# EAGLE design supply_test_2v1 (EAGLE 6.5.0)

## Sheet 1 of 3: AC-DC Power Supply
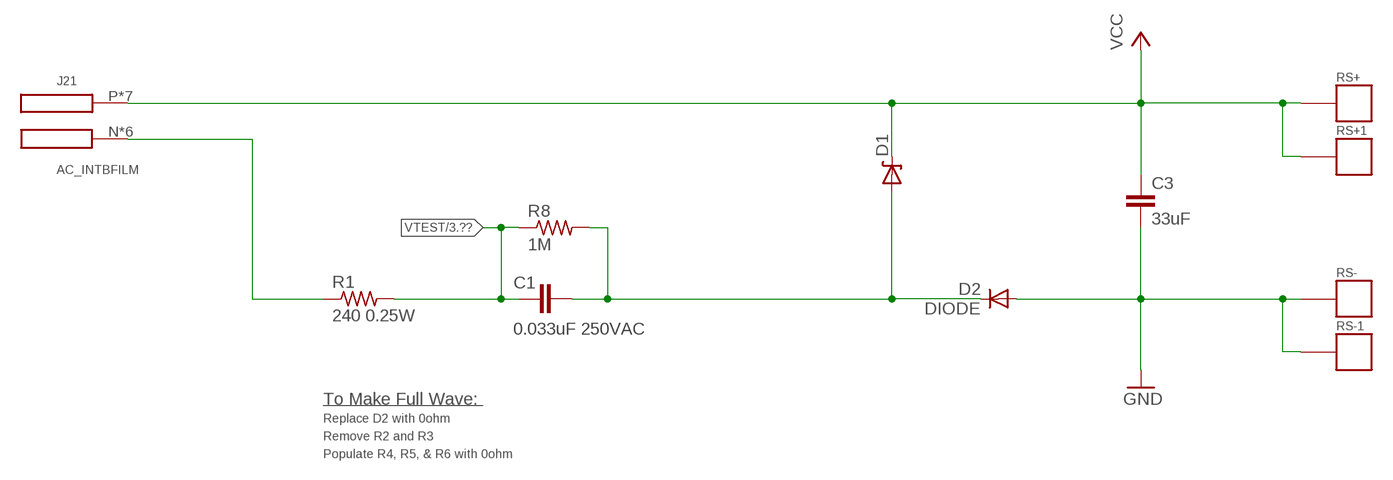
[diagram p0: schematic, sheet 1]

### Parts
C1  0.033uF 250VAC  C-EUEDGE  [C2220-EDGE]
C3  33uF  C-EUC0603  [C0603]
D1  ZENERBZT52  [BZT52]
D2  DIODE  [BAS521]
J21  AC_INTBFILM  [AC3_TBFILM]
R1  240 0.25W  R-US_R0603  [R0603]
R8  1M  R-US_R0603  [R0603]
RS+  TP_LONG  [TP_LONG]
RS+1  TP_SMD  [TP_SMD]
RS-  TP_LONG  [TP_LONG]
RS-1  TP_SMD  [TP_SMD]

### Nets
GND: C3.2 D2.A RS-1.P$1 RS-.P$1 ; also sheet 2,3
N$2: J21.N J21.N1(N) J21.N2(N) J21.N3(N) J21.N4(N) J21.N5(N) R1.1
N$4: C1.1 D1.A D2.C R8.2
VCC: C3.1 D1.C J21.P J21.P1(P) J21.P2(P) J21.P3(P) J21.P4(P) J21.P5(P) J21.P6(P) RS+1.P$1 RS+.P$1 ; also sheet 2
VTEST: C1.2 R1.2 R8.1 ; also sheet 3

### Notes on the sheet
- To Make Full Wave:
- Replace D2 with 0ohm
- Remove R2 and R3
- Populate R4, R5, & R6 with 0ohm

## Sheet 2 of 3: Load Supply Regulation
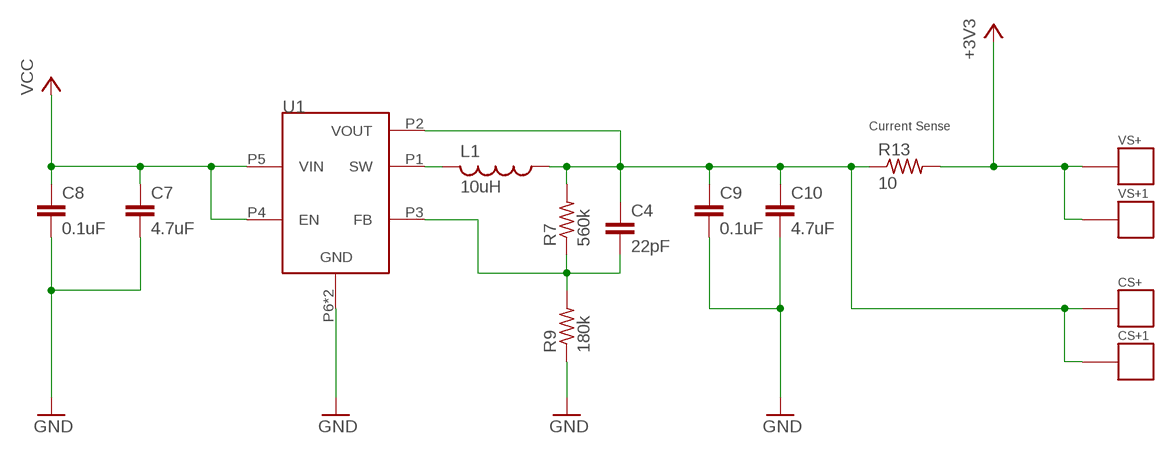
[diagram p1: schematic, sheet 2]

### Parts
C4  22pF  C-EUC0402  [C0402]
C7  4.7uF  C-EUC0402  [C0402]
C8  0.1uF  C-EUC0402  [C0402]
C9  0.1uF  C-EUC0402  [C0402]
C10  4.7uF  C-EUC0603  [C0603]
CS+  TP_LONG  [TP_LONG]
CS+1  TP_SMD  [TP_SMD]
L1  10uH  L-USL0805  [L0805]
R7  560k  R-US_R0402  [R0402]
R9  180k  R-US_R0402  [R0402]
R13  10  R-US_R0603  [R0603]
U1  TPS62122  [WDFN-6]
VS+  TP_LONG  [TP_LONG]
VS+1  TP_SMD  [TP_SMD]

### Nets
+3V3: R13.2 VS+1.P$1 VS+.P$1 ; also sheet 3
GND: C7.2 C8.2 C9.2 C10.2 R9.1 U1.P6(GND) U1.PAD(GND) ; also sheet 1,3
N$9: L1.2 U1.P1(SW)
N$11: C4.1 C9.1 C10.1 CS+1.P$1 CS+.P$1 L1.1 R7.2 R13.1 U1.P2(VOUT)
N$13: C4.2 R7.1 R9.2 U1.P3(FB)
VCC: C7.1 C8.1 U1.P4(EN) U1.P5(VIN) ; also sheet 1

### Notes on the sheet
- Current Sense

## Sheet 3 of 3: Power Sensing!
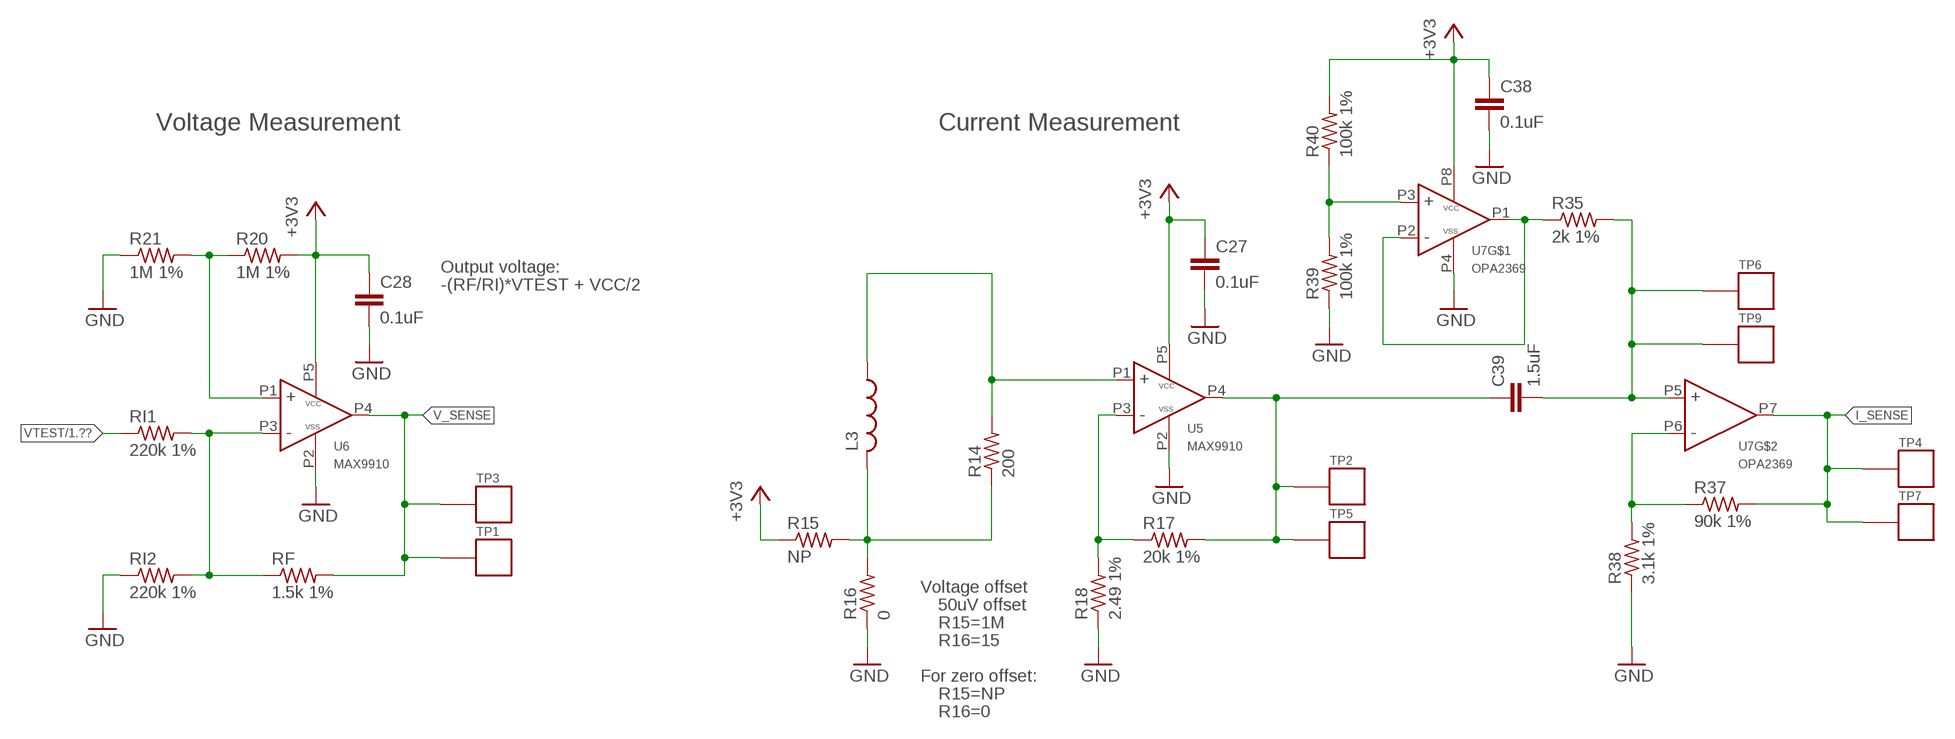
[diagram p2: schematic, sheet 3]

### Parts
C27  0.1uF  C-EUC0402  [C0402]
C28  0.1uF  C-EUC0402  [C0402]
C38  0.1uF  C-EUC0402  [C0402]
C39  1.5uF  C-EUC0402  [C0402]
L3  L-USL0805  [L0805]
R14  200  R-US_R0402  [R0402]
R15  NP  R-US_R0402  [R0402]
R16  0  R-US_R0402  [R0402]
R17  20k 1%  R-US_R0402  [R0402]
R18  2.49 1%  R-US_R0402  [R0402]
R20  1M 1%  R-US_R0402  [R0402]
R21  1M 1%  R-US_R0402  [R0402]
R35  2k 1%  R-US_R0402  [R0402]
R37  90k 1%  R-US_R0402  [R0402]
R38  3.1k 1%  R-US_R0402  [R0402]
R39  100k 1%  R-US_R0402  [R0402]
R40  100k 1%  R-US_R0402  [R0402]
RF  1.5k 1%  R-US_R0402  [R0402]
RI1  220k 1%  R-US_R0402  [R0402]
RI2  220k 1%  R-US_R0402  [R0402]
TP1  TP_SMD  [TP_SMD]
TP2  TP_LONG  [TP_LONG]
TP3  TP_LONG  [TP_LONG]
TP4  TP_LONG  [TP_LONG]
TP5  TP_SMD  [TP_SMD]
TP6  TP_SMD  [TP_SMD]
TP7  TP_SMD  [TP_SMD]
TP9  TP_LONG  [TP_LONG]
U5  MAX9910  [SC70-5]
U6  MAX9910  [SC70-5]
U7  OPA2369  [SOT-23-8]

### Nets
+3V3: C27.1 C28.1 C38.1 R15.1 R20.2 R40.2 U5.P5(VCC) U6.P5(VCC) U7.P8(VCC) ; also sheet 2
GND: C27.2 C28.2 C38.2 R16.1 R18.1 R21.1 R38.1 R39.1 RI2.1 U5.P2(VSS) U6.P2(VSS) U7.P4(VSS) ; also sheet 1,2
I_SENSE: R37.2 TP4.P$1 TP7.P$1 U7.P7(OUT)
N$37: L3.2 R14.1 R15.2 R16.2
N$38: L3.1 R14.2 U5.P1(IN+)
N$40: R20.1 R21.2 U6.P1(IN+)
N$41: RF.1 RI1.2 RI2.2 U6.P3(IN-)
N$61: C39.1 R17.2 TP2.P$1 TP5.P$1 U5.P4(OUT)
N$65: R17.1 R18.2 U5.P3(IN-)
N$66: R37.1 R38.2 U7.P6(IN-)
N$67: C39.2 R35.2 TP6.P$1 TP9.P$1 U7.P5(IN+)
N$68: R35.1 U7.P1(OUT) U7.P2(IN-)
N$70: R39.2 R40.1 U7.P3(IN+)
V_SENSE: RF.2 TP1.P$1 TP3.P$1 U6.P4(OUT)
VTEST: RI1.1 ; also sheet 1

### Notes on the sheet
- Voltage Measurement | Current Measurement
- Output voltage:
- -(RF/RI)*VTEST + VCC/2
- Voltage offset
- 50uV offset
- R15=1M
- R16=15
- For zero offset:
- R15=NP
- R16=0

## Library data of the parts
C1 = rcl:C-EU: CAPACITOR, European symbol; DIGIKEY: 490-4238-1-ND
C3 = rcl:C-EU: CAPACITOR, European symbol; DIGIKEY: 718-1672-1-ND
C4 = rcl:C-EU: CAPACITOR, European symbol
C7 C10 = rcl:C-EU: CAPACITOR, European symbol; DIGIKEY: 587-2786-1-ND
C8 C9 = rcl:C-EU: CAPACITOR, European symbol; DIGIKEY: 1276-1001-1-ND
C27 C28 C38 = rcl:C-EU: CAPACITOR, European symbol; DIGIKEY: 445-1265-1-ND
C39 = rcl:C-EU: CAPACITOR, European symbol; DIGIKEY: 445-13874-1-ND
CS+ CS+1 RS+ RS+1 RS- RS-1 VS+ VS+1 = skyspecs:TP; DIGIKEY: NP
D1 = powerfilm:ZENER; DIGIKEY: BZT52C10T-7DICT-ND; DIGIKEY_2: BZT52C15T-7DICT-ND
D2 = powerfilm:DIODE; DIGIKEY: BAS521-7DICT-ND
J21 = powerfilm:AC_IN; DIGIKEY: NP
L1 = rcl:L-US: INDUCTOR, American symbol; DIGIKEY: 490-4990-1-ND
L3 = rcl:L-US: INDUCTOR, American symbol; DIGIKEY: 732-3452-1-ND
R1 = rcl:R-US_: RESISTOR, American symbol; DIGIKEY: RHM240DCT-ND
R7 R9 = rcl:R-US_: RESISTOR, American symbol
R8 = rcl:R-US_: RESISTOR, American symbol; DIGIKEY: MCT0603-1.00M-CFCT-ND
R13 = rcl:R-US_: RESISTOR, American symbol; DIGIKEY: CRT0603-BY-10R0ELFCT-ND
R14 = rcl:R-US_: RESISTOR, American symbol; DIGIKEY: P200LCT-ND
R15 = rcl:R-US_: RESISTOR, American symbol; DIGIKEY: NP
R16 = rcl:R-US_: RESISTOR, American symbol; DIGIKEY: P0.0JCT-ND
R17 = rcl:R-US_: RESISTOR, American symbol; DIGIKEY: P20.0KLCT-ND
R18 = rcl:R-US_: RESISTOR, American symbol; DIGIKEY: 541-2.49LLCT-ND
R20 R21 = rcl:R-US_: RESISTOR, American symbol; DIGIKEY: P10.0KLCT-ND
R35 = rcl:R-US_: RESISTOR, American symbol; DIGIKEY: P2.00KLCT-ND
R37 = rcl:R-US_: RESISTOR, American symbol; DIGIKEY: P90.9KLCT-ND
R38 = rcl:R-US_: RESISTOR, American symbol; DIGIKEY: P3.09KHCT-ND
R39 R40 = rcl:R-US_: RESISTOR, American symbol; DIGIKEY: P100KLCT-ND
RF = rcl:R-US_: RESISTOR, American symbol; DIGIKEY: P1.50KLCT-ND
RI1 RI2 = rcl:R-US_: RESISTOR, American symbol; DIGIKEY: P220KLCT-ND
TP1 TP3 = skyspecs:TP; DIGIKEY: 5129K-ND
TP2 TP4-TP7 TP9 = skyspecs:TP; DIGIKEY: 5126K-ND
U1 = powerfilm:TPS62122; DIGIKEY: 296-27695-1-ND
U5 U6 = powerfilm:MAX9910; DIGIKEY: MAX9910EXK+TCT-ND
U7 = powerfilm:OPA2369; DIGIKEY: 296-22671-1-ND

## Board
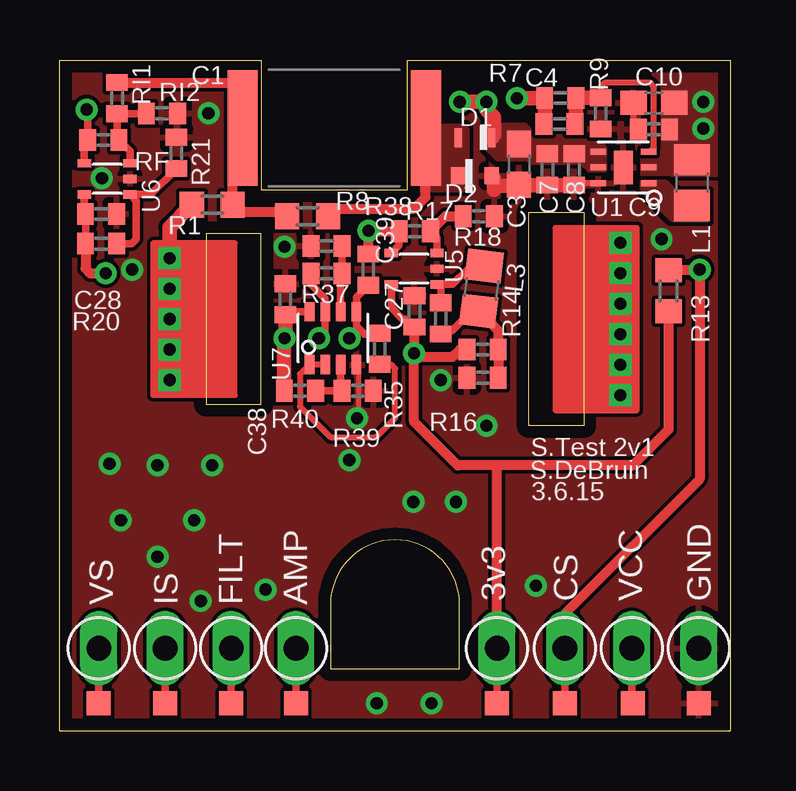
[diagram p3: board, top side]
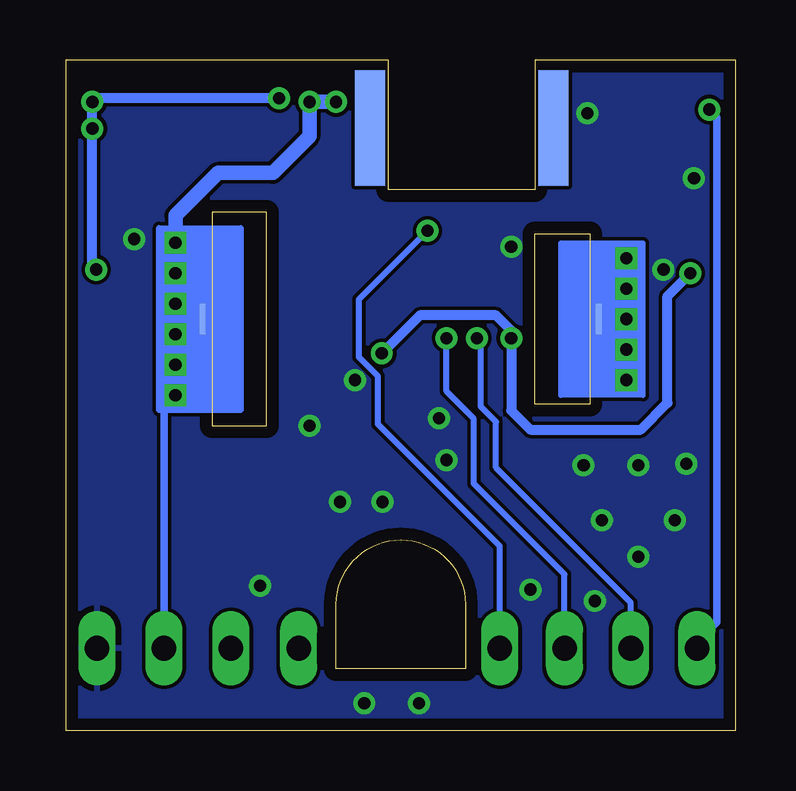
[diagram p4: board, bottom side, seen from below]

Size 27.94 x 27.94 mm. Coordinates in mm from the lower left corner, seen from the top.
Copper layers (1*16): Top 0.0178mm / dielectric 59mil / Bottom 0.0178mm
Design rules "SSC-EAGLE-2Lyr_v1.0.0.3": minimum track width 6mil, minimum drill 14mil, track to track 6mil, track to pad 6mil, pad to pad 6mil, via to via 6mil, smd to smd 6mil, copper to edge 20mil, drill to drill 16mil, minimum pad ring 8mil, minimum via ring 8mil, stop-mask expansion 3mil, vias tented up to drill 0mil, thermal gap 10mil

### Footprints (pad centres in the part's own frame; a part is rotated, then mirrored left to right if it is on the bottom)
C2220-EDGE = smd 1.25 x 4.8: 1 -3.82,0; 2 3.82,0 | smd 1.25 x 4.8 bottom: 3 3.82,0; 4 -3.82,0
C0603 = smd 1.1 x 1: 1 -0.85,0; 2 0.85,0
C0402 = smd 0.7 x 0.9: 1 -0.65,0; 2 0.65,0
TP_LONG = drill 1.029 long: P$1 0,0
TP_SMD = smd 1 x 1: P$1 0,0
BZT52 = smd 0.3 x 0.8: A -0.7,0; C 0.7,0
BAS521 = smd 0.6 x 0.7: A -0.7,0; C 0.7,0
AC3_TBFILM = smd 0.254 x 1.27 bottom: N -8.255,0; P 8.255,0 | drill 0.508 square: N1 -9.398,-2.54; N2 -9.398,-1.27; N3 -9.398,0; N4 -9.398,1.27; N5 -9.398,2.54; P1 9.398,-3.175; P2 9.398,-1.905; P3 9.398,-0.635; P4 9.398,0.635; P5 9.398,1.905; P6 9.398,3.175
L0805 = smd 1.3 x 1.5: 1 -0.95,0; 2 0.95,0
R0603 = smd 1 x 1.1: 1 -0.85,0; 2 0.85,0
R0402 = smd 0.7 x 0.9: 1 -0.65,0; 2 0.65,0
WDFN-6 = smd 0.65 x 0.25: P1 -1.05,0.65; P2 -1.05,0; P3 -1.05,-0.65; P4 1.05,-0.65; P5 1.05,0; P6 1.05,0.65 | smd 0.8 x 1.4: PAD 0,0
SC70-5 = smd 0.55 x 0.35: P1 -0.95,0.65; P2 -0.95,0; P3 -0.95,-0.65; P4 0.95,-0.65; P5 0.95,0.65
SOT-23-8 = smd 0.8 x 0.4: P1 -1.1,0.975; P2 -1.1,0.325; P3 -1.1,-0.325; P4 -1.1,-0.975; P5 1.1,-0.975; P6 1.1,-0.325; P7 1.1,0.325; P8 1.1,0.975

### Placement (x,y rotation side)
C1  11.43,25.11 180 top
C3  19.13,23.59 270 top
C4  20.82,25.27 0 top
C7  20.32,23.38 270 top
C8  21.43,23.38 270 top
C9  24.77,25.05 180 top
C10  24.77,26.16 180 top
C27  14.78,17.46 90 top
C28  1.71,21.53 0 top
C38  9.4,17.97 90 top
C39  12.86,19.21 270 top
CS+  21.05,3.43 90 top
CS+1  21.05,1.14 0 top
D1  17.3,24.7 0 top
D2  17.3,23.11 180 top
J21  13.97,17.14 0 top
L1  26.35,22.83 270 top
L3  17.58,18.41 262.9 top
R1  6.35,21.91 0 top
R7  20.86,26.35 180 top
R8  10.32,21.43 0 top
R9  22.54,25.72 90 top
R13  25.37,18.32 270 top
R14  15.88,17.18 90 top
R15  17.62,15.88 0 top
R16  17.62,14.7 0 top
R17  14.8,20.8 180 top
R18  17.46,21.43 180 top
R20  1.71,20.29 180 top
R21  4.86,24.07 270 top
R35  13.34,15.91 90 top
R37  11.11,19.05 180 top
R38  11.11,20.19 0 top
R39  12.41,14.16 180 top
R40  10,14.16 180 top
RF  1.81,24.61 180 top
RI1  2.38,26.35 270 top
RI2  4.25,25.72 180 top
RS+  23.84,3.43 90 top
RS+1  23.88,1.14 0 top
RS-  26.64,3.43 90 top
RS-1  26.64,1.14 0 top
TP1  1.62,1.14 0 top
TP2  9.84,3.43 90 top
TP3  1.62,3.43 90 top
TP4  4.38,3.43 90 top
TP5  9.84,1.14 0 top
TP6  7.14,1.14 0 top
TP7  4.38,1.14 0 top
TP9  7.14,3.43 90 top
U1  23.5,23.46 180 top
U5  14.76,19.24 180 top
U6  1.97,22.99 180 top
U7  11.38,16.35 90 top
VS+  18.22,3.43 90 top
VS+1  18.22,1.14 0 top

### Tracks (layer width: path | path; a pad name or v marks a point on that pad's centre or on a via)
+3V3  (via drill 0.51)
  Top 0.305: U6.P5 1.02,21.57 C28.1 R20.2 | C38.1 9.53,17.45 U7.P8 | C27.1 14.45,17.14 14.29,17.14 13.81,17.62 U5.P5 | VS+1.P$1 VS+.P$1
  Top 0.406: C27.1 14.76,16.79 v14.76,15.72 | R20.2 1.07,19.26 1.27,19.05 v1.91,19.05 | R15.1 16.67,15.88 16.35,15.56 14.92,15.56 v14.76,15.72 | R13.2 25.37,12.54 23.88,11.05 18.1,11.05 | 18.1,11.05 16.57,11.05 14.76,12.86 v14.76,15.72 | VS+.P$1 18.23,10.92 18.1,11.05
  Top 0.61: C38.1 9.4,16.38 v9.37,16.35 9.35,16.34 R40.2
  Bottom 0.406: v14.76,15.72 13.18,17.3 10,17.3 9.37,16.67 v9.37,16.35 9.37,13.33 8.57,12.54 3.97,12.54 2.86,13.65 2.86,18.1 v1.91,19.05
GND  (via drill 0.51)
  Top 0.203: U7.P4 12.45,15.16 12.45,13.33 12.22,13.11 12.22,13.02
  Top 0.254: C10.2 23.91,25.25 C9.2 | U1.P6 21.48,22.81 21.43,22.86
  Top 0.61: C8.2 19.08,22.73 19.05,22.7 18.26,22.7 18.1,22.54 18.1,23.02 D2.A
  other vias: 9.37,20.16 12.38,13.02 6.19,25.72 1.75,23.02 15.88,14.61 14.73,9.52 16.51,9.52 12.07,11.27 8.57,5.87 5.87,5.4 5.59,8.76 4.06,11.05 2.06,11.11 2.54,8.76 4.06,7.24 6.35,11.05 15.49,1.14 13.21,1.14 25.08,20.48 17.78,12.7 19.84,6.03 3.02,19.21
  pour Top (rank 6): 0,28.57 27.94,28.57 27.94,-0.64 0,-0.64
  pour Bottom (rank 6): 0,28.57 27.94,28.57 27.94,-0.64 0,-0.64
I_SENSE  (via drill 0.51)
  Top 0.305: R37.2 10.46,18.59 11.05,18 U7.P7 11.05,16.61 v10.8,16.35 | TP7.P$1 TP4.P$1
  Bottom 0.254: TP4.P$1 4.38,5.33 10,10.95 10,12.86 10.64,13.49 10.64,16.19 v10.8,16.35
N$2
  Top 0.61: 4.45,19.81 J21.N5 | J21.N5 J21.N4 J21.N3 J21.N2 | R1.1 4.57,20.98 J21.N5
  Bottom 0.203: J21.N J21.N3
  Bottom 0.61: J21.N1 J21.N2
N$4
  Top 0.406: R8.2 11.27,21.43 11.59,21.75 14.76,21.75 15.24,22.23 C1.1
  pour Top (no thermals): 16.99,25.02 16.83,25.18 14.76,25.18 14.61,24.92 14.61,22.7 14.76,22.54 16.83,22.54 16.99,22.7
N$9
  pour Top (no thermals): 24.29,22.86 25.24,22.86 25.72,22.38 26.99,22.38 26.99,21.27 25.56,21.27 24.29,22.54
N$11  (via drill 0.51)
  Top 0.305: CS+1.P$1 CS+.P$1
  Top 0.406: R13.1 25.41,19.21 v26.67,19.21 26.67,10.48 21.11,4.92 21.11,3.49 CS+.P$1
  Top 0.61: C4.1 20.21,25.31 R7.2 v19.05,26.35
  Bottom 0.406: v19.05,26.35 26.67,26.35 v26.83,26.19 v26.83,25.08 26.83,19.37 v26.67,19.21
  pour Top (rank 3, no thermals): 24.77,26.51 24.77,24.29 24.29,23.81 24.29,23.18 27.94,23.18 27.94,27.78 27.78,27.94 24.92,27.94 24.77,27.78
N$13
  Top 0.254: U1.P3 24.59,24.11 24.77,24.29 24.77,26.83 24.61,26.99 22.7,26.99 22.54,26.83 R9.2
  Top 0.61: C4.2 21.51,25.31 R7.1 21.52,26.37 R9.2
N$37
  Top 0.305: R14.1 16.02,16.67 16.35,16.67 17.16,17.47
  Top 0.406: 17.16,17.47 L3.2 18.27,16.66 R15.2 R16.2
N$38
  Top 0.305: 17.55,19.21 16.99,19.21 16.37,18.59 U5.P1 15.88,18.43 R14.2
  Top 0.406: 17.55,19.21 L3.1
N$40
  Top 0.305: R20.1 2.98,20.29 3.18,20.48 3.18,22.08 U6.P1 3.78,22.34 R21.2
N$41
  Top 0.305: U6.P3 2.92,24.15 RF.1 2.38,24.68 RI1.2 3.59,25.7 RI2.2
N$61  (via drill 0.51)
  Top 0.305: U5.P4 14.15,20.22 R17.2 | v12.86,20.83 v12.87,20.82 12.87,20.8 | TP5.P$1 TP2.P$1
  Top 0.406: C39.1 12.87,20.8 R17.2
  Bottom 0.254: TP2.P$1 9.84,7.68 14.92,12.76 14.92,14.76 15.72,15.56 15.72,17.97 v12.86,20.83
N$65
  Top 0.305: U5.P3 15.71,20.53 R17.1
  Top 0.406: R17.1 16.07,21.43 R18.2
N$66
  Top 0.305: U7.P6 11.7,18.99 R37.1 R38.2
N$67  (via drill 0.51)
  Top 0.305: C39.2 12.35,18.05 U7.P5 12.35,16.86 | 12.35,16.86 12.7,16.51 13.29,16.51 R35.2 | TP6.P$1 TP9.P$1 | 12.35,16.86 12.35,16.64 v12.07,16.35
  Bottom 0.254: TP9.P$1 7.14,6.51 10.92,10.29 10.92,12.99 12.07,14.13 v12.07,16.35
N$68
  Top 0.254: U7.P2 U7.P1 10,14.85 10,13.49 11.27,12.22 13.18,12.22 13.97,13.02 13.97,15.08 13.79,15.26 R35.1
N$70
  Top 0.305: U7.P3 11.7,14.22 R39.2 R40.1
V_SENSE  (via drill 0.51)
  Top 0.305: U6.P4 1.02,24.46 RF.2 1.16,25.83 v1.11,25.88 | TP1.P$1 TP3.P$1
  Bottom 0.305: v1.11,25.88 0.79,25.56 0.79,4.51 1.62,3.68 TP3.P$1
VCC  (via drill 0.51)
  Top 0.305: RS+1.P$1 23.84,1.17 RS+.P$1
  Top 0.61: v16.67,26.19 v17.78,26.19 17.78,25.88 18.1,25.56 18.1,24.8 D1.C
  Bottom 0.305: J21.P1 23.84,13.49 RS+.P$1
  Bottom 0.61: v16.67,26.19 v17.78,26.19 17.78,24.77 19.3,23.24 21.59,23.24 23.37,21.46 J21.P6 J21.P5 J21.P4 | J21.P4 J21.P3 J21.P2 J21.P1 | J21.P 22.86,17.78 J21.P4
  pour Top (rank 3, no thermals): 22.7,23.34 22.07,23.34 21.75,23.65 19.69,23.65 19.53,23.81 18.26,23.81 17.78,24.29 17.78,25.24 19.37,25.24 19.84,24.77 22.23,24.77 22.7,24.29
VTEST
  Top 0.406: R8.1 9.31,21.59 7.52,21.59 R1.2 7.2,24.7 C1.2 7.87,25.37 7.87,26.29 7.11,27.05 7.06,27 RI1.1

### Text on the board
tPlace: S.Test 2v1 | S.DeBruin | 3.6.15 | VS | IS | FILT | AMP | 3v3 | CS | VCC | GND